# Altium project steering_wheel_unit.PrjPcb (part 1 of 2)
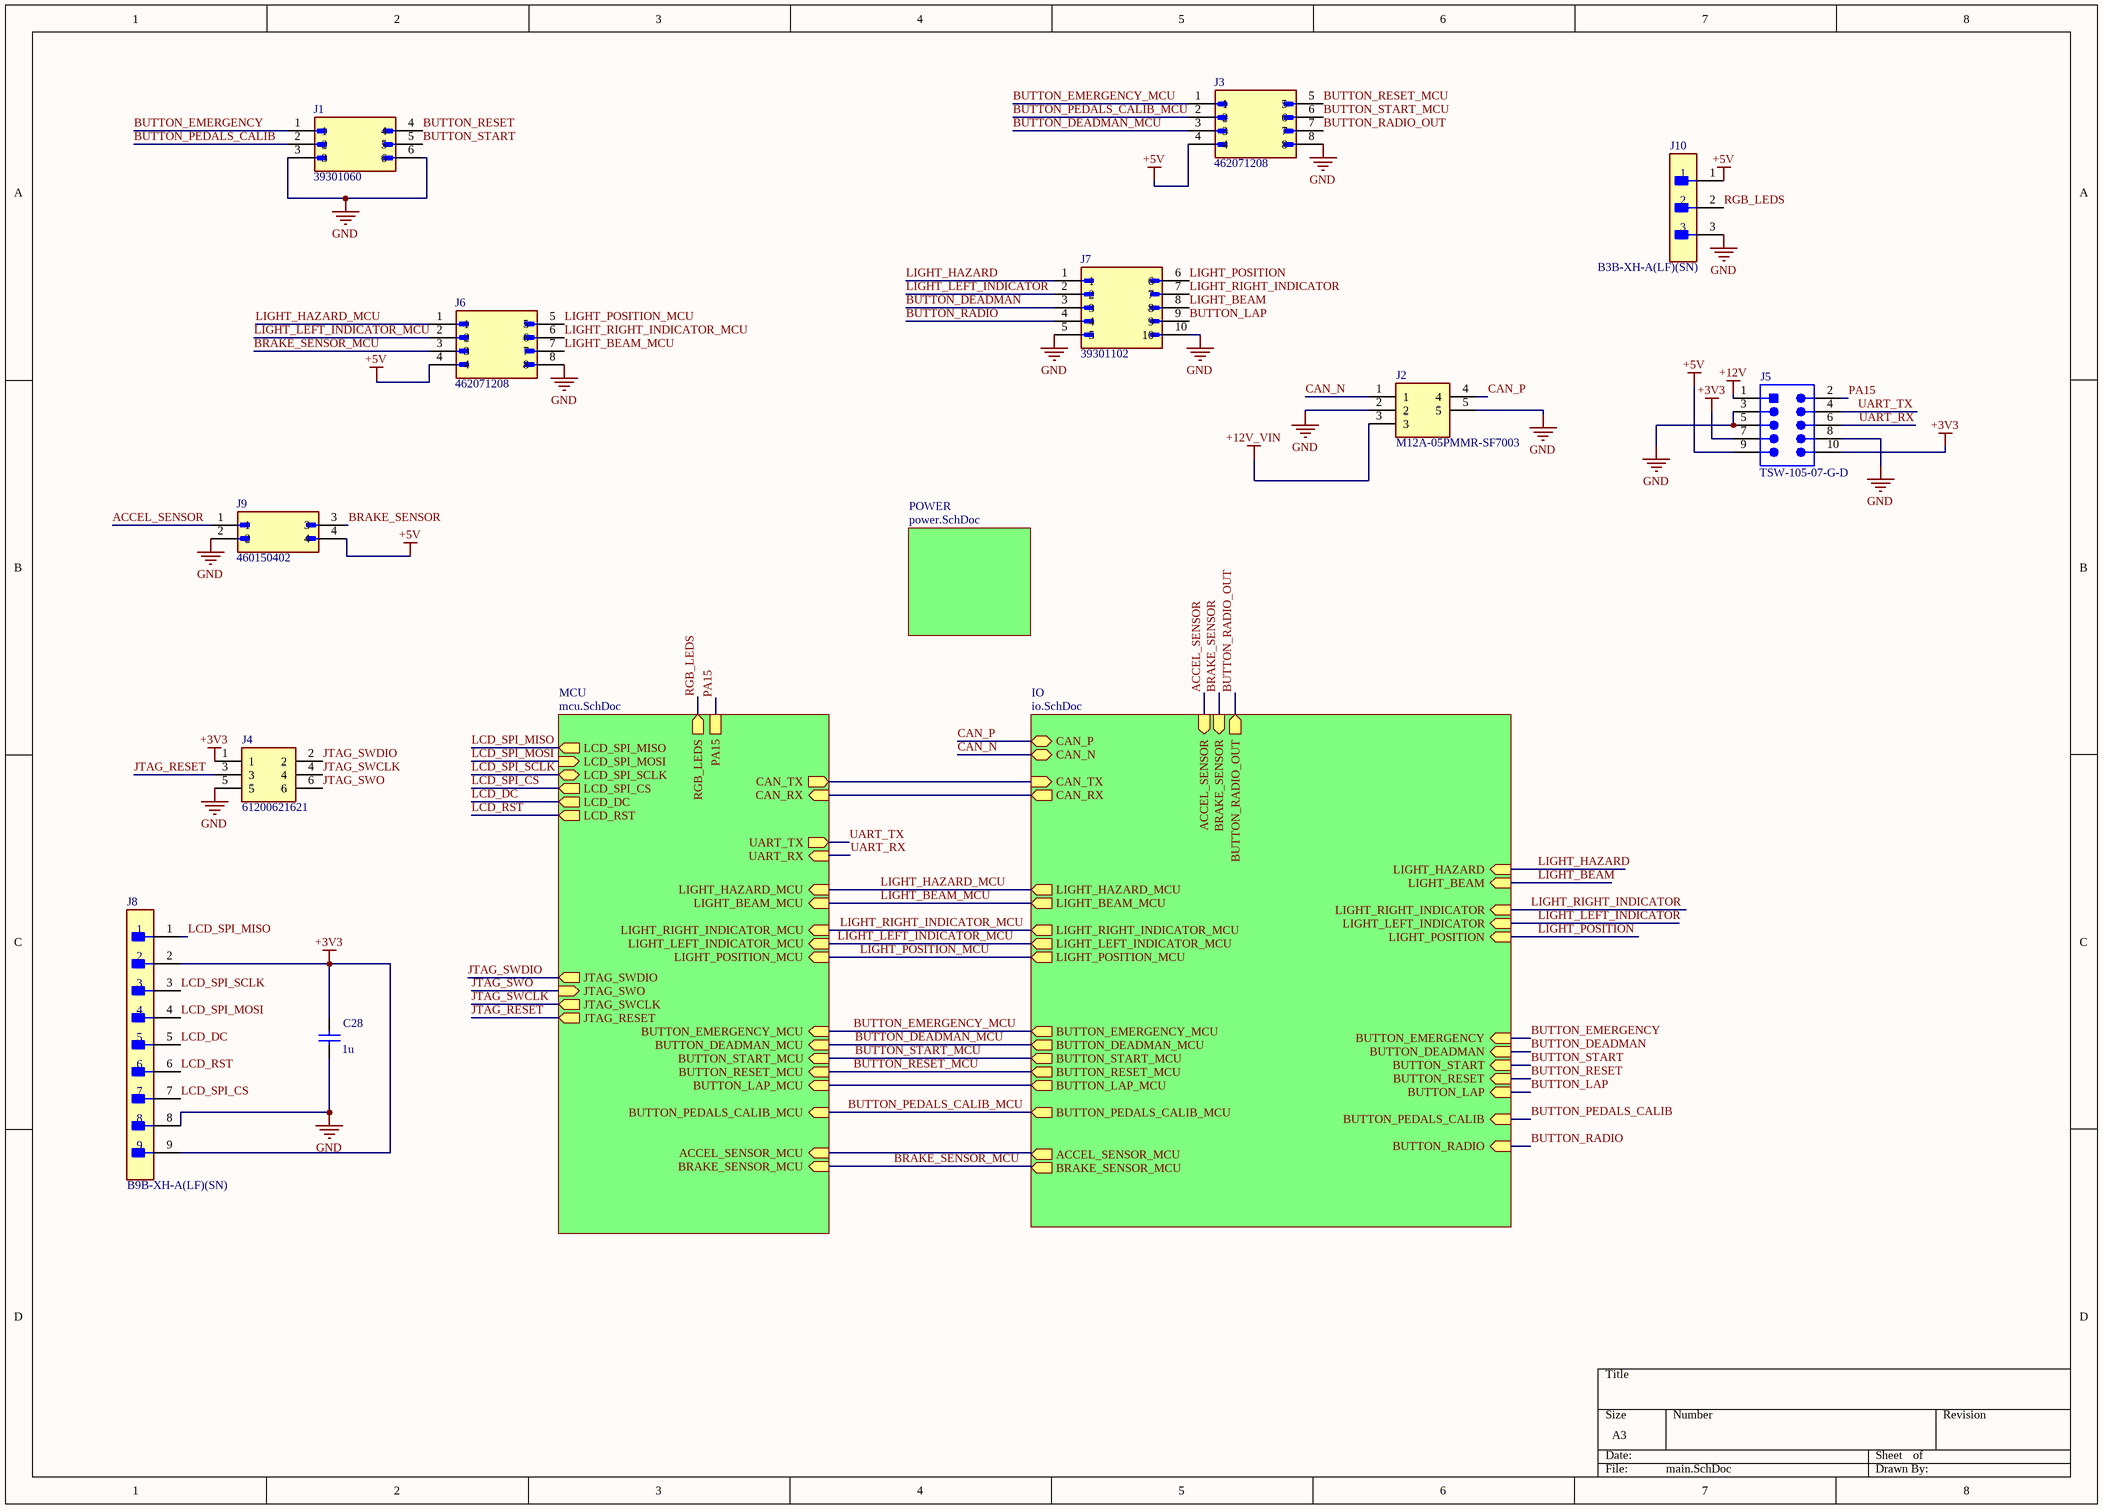
[diagram p0: main.SchDoc]
4 sheets, 161 parts. Net scope: hierarchical (ports join the sheet entries above them; power ports are global).
Board file: steering_wheel_pcb.PcbDoc
Sheets:
  main.SchDoc
    MCU = mcu.SchDoc
    IO = io.SchDoc
    POWER = power.SchDoc

## Sheet main.SchDoc
size A3; SheetNumber: 1; SheetTotal: 4

### Parts
C28  1u  [CAPC1206(3216)150_L]
J1  39301060  [39301060]
J2  M12A-05PMMR-SF7003  [M12A05PMMRSF7003]
J3  462071208  [462071208]
J4  61200621621  [61200621621]
J5  TSW-105-07-G-D  [SMTC-TSW-105-07-G-D_V]
J6  462071208  [462071208]
J7  39301102  [39301102]
J8  B9B-XH-A(LF)(SN)  [FP-B9B-XH-A_LF_SN-MFG]
J9  460150402  [460150402]
J10  B3B-XH-A(LF)(SN)  [FP-B3B-XH-A_LF_SN-MFG]

### Sub-sheets
IO = io.SchDoc: CAN_TX (in), CAN_RX (out), CAN_P (bidir), CAN_N (bidir), LIGHT_HAZARD_MCU (out), LIGHT_BEAM_MCU (out), LIGHT_RIGHT_INDICATOR_MCU (out), LIGHT_LEFT_INDICATOR_MCU (out), LIGHT_POSITION_MCU (out), LIGHT_HAZARD (in), LIGHT_BEAM (in), LIGHT_RIGHT_INDICATOR (in), LIGHT_LEFT_INDICATOR (in), LIGHT_POSITION (in), BUTTON_EMERGENCY_MCU (out), BUTTON_DEADMAN_MCU (out), BUTTON_START_MCU (out), BUTTON_RESET_MCU (out), BUTTON_LAP_MCU (out), BUTTON_PEDALS_CALIB_MCU (out), BUTTON_EMERGENCY (in), BUTTON_DEADMAN (in), BUTTON_START (in), BUTTON_RESET (in), BUTTON_LAP (in), BUTTON_PEDALS_CALIB (in), BUTTON_RADIO (in), ACCEL_SENSOR_MCU (out), BRAKE_SENSOR_MCU (out), ACCEL_SENSOR (in), BRAKE_SENSOR (in), BUTTON_RADIO_OUT (out)
MCU = mcu.SchDoc: CAN_TX (out), CAN_RX (in), UART_TX (out), UART_RX (in), JTAG_SWDIO (out), JTAG_SWO (in), JTAG_SWCLK (out), JTAG_RESET (out), LCD_SPI_MISO (out), LCD_SPI_MOSI (in), LCD_SPI_SCLK (bidir), LCD_SPI_CS (out), LCD_DC (out), LCD_RST (out), LIGHT_HAZARD_MCU (in), LIGHT_BEAM_MCU (in), LIGHT_RIGHT_INDICATOR_MCU (in), LIGHT_LEFT_INDICATOR_MCU (in), LIGHT_POSITION_MCU (in), BUTTON_EMERGENCY_MCU (in), BUTTON_DEADMAN_MCU (in), BUTTON_START_MCU (in), BUTTON_RESET_MCU (in), BUTTON_LAP_MCU (in), BUTTON_PEDALS_CALIB_MCU (in), PA15, ACCEL_SENSOR_MCU (in), BRAKE_SENSOR_MCU (in), RGB_LEDS (out)
POWER = power.SchDoc: no entries

### Nets
+3V3: C28.1 J4.1 J5.7 J5.10 J8.2 J8.9
+5V: J3.4 J5.9 J6.4 J9.4 J10.1
+12V: J5.1
+12V_VIN: J2.3
GND: C28.2 J1.3 J1.6 J2.2 J2.5 J3.8 J4.5 J5.3 J5.5 J5.8 J6.8 J7.5 J7.10 J8.8 J9.2 J10.3
ACCEL_SENSOR: J9.1 ; sheet IO/ACCEL_SENSOR
ACCEL_SENSOR_MCU: sheet MCU/ACCEL_SENSOR_MCU, sheet IO/ACCEL_SENSOR_MCU
BRAKE_SENSOR: J9.3 ; sheet IO/BRAKE_SENSOR
BRAKE_SENSOR_MCU: J6.3 ; sheet MCU/BRAKE_SENSOR_MCU, sheet IO/BRAKE_SENSOR_MCU
BUTTON_DEADMAN: J7.3 ; sheet IO/BUTTON_DEADMAN
BUTTON_DEADMAN_MCU: J3.3 ; sheet MCU/BUTTON_DEADMAN_MCU, sheet IO/BUTTON_DEADMAN_MCU
BUTTON_EMERGENCY: J1.1 ; sheet IO/BUTTON_EMERGENCY
BUTTON_EMERGENCY_MCU: J3.1 ; sheet MCU/BUTTON_EMERGENCY_MCU, sheet IO/BUTTON_EMERGENCY_MCU
BUTTON_LAP: J7.9 ; sheet IO/BUTTON_LAP
BUTTON_LAP_MCU: sheet MCU/BUTTON_LAP_MCU, sheet IO/BUTTON_LAP_MCU
BUTTON_PEDALS_CALIB: J1.2 ; sheet IO/BUTTON_PEDALS_CALIB
BUTTON_PEDALS_CALIB_MCU: J3.2 ; sheet MCU/BUTTON_PEDALS_CALIB_MCU, sheet IO/BUTTON_PEDALS_CALIB_MCU
BUTTON_RADIO: J7.4 ; sheet IO/BUTTON_RADIO
BUTTON_RADIO_OUT: J3.7 ; sheet IO/BUTTON_RADIO_OUT
BUTTON_RESET: J1.4 ; sheet IO/BUTTON_RESET
BUTTON_RESET_MCU: J3.5 ; sheet MCU/BUTTON_RESET_MCU, sheet IO/BUTTON_RESET_MCU
BUTTON_START: J1.5 ; sheet IO/BUTTON_START
BUTTON_START_MCU: J3.6 ; sheet MCU/BUTTON_START_MCU, sheet IO/BUTTON_START_MCU
CAN_N: J2.1 ; sheet IO/CAN_N
CAN_P: J2.4 ; sheet IO/CAN_P
CAN_RX: sheet MCU/CAN_RX, sheet IO/CAN_RX
CAN_TX: sheet MCU/CAN_TX, sheet IO/CAN_TX
JTAG_RESET: J4.3 ; sheet MCU/JTAG_RESET
JTAG_SWCLK: J4.4 ; sheet MCU/JTAG_SWCLK
JTAG_SWDIO: J4.2 ; sheet MCU/JTAG_SWDIO
JTAG_SWO: J4.6 ; sheet MCU/JTAG_SWO
LCD_DC: J8.5 ; sheet MCU/LCD_DC
LCD_RST: J8.6 ; sheet MCU/LCD_RST
LCD_SPI_CS: J8.7 ; sheet MCU/LCD_SPI_CS
LCD_SPI_MISO: J8.1 ; sheet MCU/LCD_SPI_MISO
LCD_SPI_MOSI: J8.4 ; sheet MCU/LCD_SPI_MOSI
LCD_SPI_SCLK: J8.3 ; sheet MCU/LCD_SPI_SCLK
LIGHT_BEAM: J7.8 ; sheet IO/LIGHT_BEAM
LIGHT_BEAM_MCU: J6.7 ; sheet MCU/LIGHT_BEAM_MCU, sheet IO/LIGHT_BEAM_MCU
LIGHT_HAZARD: J7.1 ; sheet IO/LIGHT_HAZARD
LIGHT_HAZARD_MCU: J6.1 ; sheet MCU/LIGHT_HAZARD_MCU, sheet IO/LIGHT_HAZARD_MCU
LIGHT_LEFT_INDICATOR: J7.2 ; sheet IO/LIGHT_LEFT_INDICATOR
LIGHT_LEFT_INDICATOR_MCU: J6.2 ; sheet MCU/LIGHT_LEFT_INDICATOR_MCU, sheet IO/LIGHT_LEFT_INDICATOR_MCU
LIGHT_POSITION: J7.6 ; sheet IO/LIGHT_POSITION
LIGHT_POSITION_MCU: J6.5 ; sheet MCU/LIGHT_POSITION_MCU, sheet IO/LIGHT_POSITION_MCU
LIGHT_RIGHT_INDICATOR: J7.7 ; sheet IO/LIGHT_RIGHT_INDICATOR
LIGHT_RIGHT_INDICATOR_MCU: J6.6 ; sheet MCU/LIGHT_RIGHT_INDICATOR_MCU, sheet IO/LIGHT_RIGHT_INDICATOR_MCU
PA15: J5.2 ; sheet MCU/PA15
RGB_LEDS: J10.2 ; sheet MCU/RGB_LEDS
UART_RX: J5.6 ; sheet MCU/UART_RX
UART_TX: J5.4 ; sheet MCU/UART_TX

### Library data of the parts
C28 = CMP-1037-04778-1: CAP 1.8uF 10V ±5% 1206 (3216 Metric) Thickness 1.45mm SMD; Case-EIA: 1206; Tolerance: Â±5%; Case-Metric: 3216; Technology: SMT; Value: 1.8uF; Rated Voltage: 10 V; Max Thickness: 1.45 mm
J1 = 39301060: Mini-Fit Jr. Through Hole PCB Header, Right Angle, 6 Contacts, 2 Rows, 4.2mm Pitch; Manufacturer: Molex; Manufacturer Lifecycle Status: ACTIVE; Approvals: CSA, TUV, UL; Connector Type: Power, Rectangular; Contact Resistance: 10mΩ; Current Rating: 8A; Gender: Male; Glow Wire Compliant: Non-compliant; Insulation Resistance: 1GΩ; Max Voltage Rating (AC): 600V; Number of Circuits: 4; Number of Contacts: 6; Number of Lines: 2; Plating Thickness: 2.54µm; Row Spacing: 5.5mm; Test Voltage: 1.5kV; Price: None; Value: *; Availability: Unavailable; MP: 39301060; Package: None; Supplier: RS; Supplier Part Number: 5109859P; Manufacturer Part Number: 39-30-1060; RoHS: Compliant; Category: Headers and Wire Housings; Stock: 3490; China RoHS: Compliant; Color: Natural; Contact Gender: Male; Contact Material: Brass; Contact Plating: Tin; Country of Origin: US; Depth: 12.8mm; ELV: Compliant; Flammability Rating: UL94 V-2; Halogen Free: Low Halogen; Height: 11.65mm; Housing Color: Natural; Housing Material: Nylon; Lead Free: Lead Free; Lead Pitch: 4.2mm; Length: 13.8mm; Lifecycle Status: Production; Material: Nylon; Max Current Rating: 8A; Max Operating Temperature: 105°C; Min Operating Temperature: -40°C; Mounting Technology: PCB, Through Hole; Pins: 6; Number of Poles: 6; Number of Positions: 6; Number of Rows: 1; Orientation: Right Angle, Vertical; Packaging: Bulk; Pitch: 4.2mm; Radiation Hardening: No; REACH SVHC: Yes; Schedule B: 8536694040, 8536694040|8536694040|8536694040|8536694040|8536694040|8536694040|8536694040|8536694040|8536694040|8536694040|8536694040|8536694040|8536694040|8536694040|8536694040|8536694040|8536694040|8536694040|8536694040|8536694040|8536694040|8536694040|8536694040|85; Termination: Solder; Voltage Rating: 600V; Voltage Rating (AC): 600V; Voltage Rating (DC): 600V; Working Voltage: 600V; ComponentLink1URL: https://datasheet.octopart.com:443/39-30-1060-Molex-datasheet-120074128.pdf?src-supplier=Farnell; ComponentLink1Description: https://datasheet.octopart.com:443/39-30-1060-Molex-datasheet-120074128.pdf?src-supplier=Farnell; ComponentLink2URL: https://datasheet.octopart.com:443/39-30-1060-Molex-datasheet-101582409.pdf?src-supplier=Farnell; ComponentLink2Description: https://datasheet.octopart.com:443/39-30-1060-Molex-datasheet-101582409.pdf?src-supplier=Farnell; ComponentLink3URL: https://datasheet.octopart.com:443/39-30-1060-Molex-datasheet-14359237.pdf?src-supplier=Farnell; ComponentLink3Description: https://datasheet.octopart.com:443/39-30-1060-Molex-datasheet-14359237.pdf?src-supplier=Farnell; ComponentLink4URL: https://datasheet.octopart.com:443/39-30-1060-Molex-datasheet-8451564.pdf?src-supplier=Farnell; ComponentLink4Description: https://datasheet.octopart.com:443/39-30-1060-Molex-datasheet-8451564.pdf?src-supplier=Farnell; ComponentLink5URL: https://datasheet.octopart.com:443/39-30-1060-Molex-datasheet-8377082.pdf?src-supplier=Farnell; ComponentLink5Description: https://datasheet.octopart.com:443/39-30-1060-Molex-datasheet-8377082.pdf?src-supplier=Farnell; ComponentLink6URL: https://datasheet.octopart.com:443/39-30-1060-Molex-datasheet-8338264.pdf?src-supplier=Farnell; ComponentLink6Description: https://datasheet.octopart.com:443/39-30-1060-Molex-datasheet-8338264.pdf?src-supplier=Farnell; ComponentLink7URL: https://datasheet.octopart.com:443/039301060-Molex-datasheet-8338717.pdf?src-supplier=Upverter; ComponentLink7Description: https://datasheet.octopart.com:443/039301060-Molex-datasheet-8338717.pdf?src-supplier=Upverter; ComponentLink8URL: https://datasheet.octopart.com:443/39-30-1060-Molex-datasheet-13785479.pdf?src-supplier=Sager+Electronics; ComponentLink8Description: https://datasheet.octopart.com:443/39-30-1060-Molex-datasheet-13785479.pdf?src-supplier=Sager+Electronics; ComponentLink9URL: https://sigma.octopart.com:443/15644801/technical_drawing/Molex-39-30-1060.pdf?src-supplier=Molex; ComponentLink9Description: https://sigma.octopart.com:443/15644801/technical_drawing/Molex-39-30-1060.pdf?src-supplier=Molex; ComponentLink10URL: https://datasheet.octopart.com:443/39-30-1060-Molex-datasheet-154749339.pdf?src-supplier=Master+Electronics; ComponentLink10Description: https://datasheet.octopart.com:443/39-30-1060-Molex-datasheet-154749339.pdf?src-supplier=Master+Electronics; ComponentLink11URL: https://datasheet.octopart.com:443/39-30-1060-Molex-datasheet-34205327.pdf?src-supplier=Electro+Sonic; ComponentLink11Description: https://datasheet.octopart.com:443/39-30-1060-Molex-datasheet-34205327.pdf?src-supplier=Electro+Sonic; ComponentLink12URL: https://datasheet.octopart.com:443/39-30-1060-Molex-datasheet-62104200.pdf?src-supplier=Electro+Sonic; ComponentLink12Description: https://datasheet.octopart.com:443/39-30-1060-Molex-datasheet-62104200.pdf?src-supplier=Electro+Sonic; ComponentLink13URL: https://datasheet.octopart.com:443/39-30-1060-Molex-datasheet-23709672.pdf?src-supplier=Electro+Sonic; ComponentLink13Description: https://datasheet.octopart.com:443/39-30-1060-Molex-datasheet-23709672.pdf?src-supplier=Electro+Sonic; ComponentLink14URL: https://datasheet.octopart.com:443/39-30-1060-Molex-datasheet-140183176.pdf?src-supplier=RS+(Formerly+Allied+Electronics); ComponentLink14Description: https://datasheet.octopart.com:443/39-30-1060-Molex-datasheet-140183176.pdf?src-supplier=RS+(Formerly+Allied+Electronics); ComponentLink15URL: https://datasheet.octopart.com:443/39-30-1060-Molex-datasheet-120148730.pdf?src-supplier=RS+(Formerly+Allied+Electronics); ComponentLink15Description: https://datasheet.octopart.com:443/39-30-1060-Molex-datasheet-120148730.pdf?src-supplier=RS+(Formerly+Allied+Electronics); ComponentLink16URL: https://datasheet.octopart.com:443/39-30-1060-Molex-datasheet-34442213.pdf?src-supplier=RS+(Formerly+Allied+Electronics); ComponentLink16Description: https://datasheet.octopart.com:443/39-30-1060-Molex-datasheet-34442213.pdf?src-supplier=RS+(Formerly+Allied+Electronics); ComponentLink17URL: https://datasheet.octopart.com:443/39-30-1060-Molex-datasheet-9719424.pdf?src-supplier=RS+(Formerly+Allied+Electronics); ComponentLink17Description: https://datasheet.octopart.com:443/39-30-1060-Molex-datasheet-9719424.pdf?src-supplier=RS+(Formerly+Allied+Electronics); ComponentLink18URL: https://datasheet.octopart.com:443/39-30-1060-Molex-datasheet-72655.pdf?src-supplier=RS+(Formerly+Allied+Electronics); ComponentLink18Description: https://datasheet.octopart.com:443/39-30-1060-Molex-datasheet-72655.pdf?src-supplier=RS+(Formerly+Allied+Electronics); ComponentLink19URL: https://datasheet.octopart.com:443/39-30-1060-Molex-datasheet-166013077.pdf?src-supplier=Jameco; ComponentLink19Description: https://datasheet.octopart.com:443/39-30-1060-Molex-datasheet-166013077.pdf?src-supplier=Jameco; ComponentLink20URL: https://datasheet.octopart.com:443/39301060-Molex-datasheet-8215776.pdf?src-supplier=Jameco; ComponentLink20Description: https://datasheet.octopart.com:443/39301060-Molex-datasheet-8215776.pdf?src-supplier=Jameco; ComponentLink21URL: https://datasheet.octopart.com:443/39-30-1060-Molex-datasheet-33002875.pdf?src-supplier=Newark; ComponentLink21Description: https://datasheet.octopart.com:443/39-30-1060-Molex-datasheet-33002875.pdf?src-supplier=Newark; ComponentLink22URL: https://datasheet.octopart.com:443/39-30-1060-Molex-datasheet-21207487.pdf?src-supplier=Newark; ComponentLink22Description: https://datasheet.octopart.com:443/39-30-1060-Molex-datasheet-21207487.pdf?src-supplier=Newark; ComponentLink23URL: https://datasheet.octopart.com:443/39-30-1060-Molex-datasheet-2405.pdf?src-supplier=Newark; ComponentLink23Description: https://datasheet.octopart.com:443/39-30-1060-Molex-datasheet-2405.pdf?src-supplier=Newark; ComponentLink24URL: https://datasheet.octopart.com:443/39-30-1060-Molex-datasheet-21395541.pdf?src-supplier=TME; ComponentLink24Description: https://datasheet.octopart.com:443/39-30-1060-Molex-datasheet-21395541.pdf?src-supplier=TME; ComponentLink25URL: https://datasheet.octopart.com:443/0039301060-Molex-datasheet-11554567.pdf?src-supplier=Arrow+Electronics; ComponentLink25Description: https://datasheet.octopart.com:443/0039301060-Molex-datasheet-11554567.pdf?src-supplier=Arrow+Electronics; ComponentLink26URL: https://datasheet.octopart.com:443/39-30-1060-Molex-datasheet-8361750.pdf?src-supplier=Verical; ComponentLink26Description: https://datasheet.octopart.com:443/39-30-1060-Molex-datasheet-8361750.pdf?src-supplier=Verical; ComponentLink27URL: https://datasheet.octopart.com:443/39-30-1060-Molex-datasheet-129274.pdf?src-supplier=DigiKey; ComponentLink27Description: https://datasheet.octopart.com:443/39-30-1060-Molex-datasheet-129274.pdf?src-supplier=DigiKey; ComponentLink28URL: http://sigma.octopart.com:80/15645378/rohs_certificate/Molex-39-30-1060.pdf?src-supplier=Compliance+Statements; ComponentLink28Description: http://sigma.octopart.com:80/15645378/rohs_certificate/Molex-39-30-1060.pdf?src-supplier=Compliance+Statements; ComponentLink29URL: http://sigma.octopart.com:80/conflict_mineral_statement/Molex-company-72.pdf?src-supplier=Compliance+Statements; ComponentLink29Description: http://sigma.octopart.com:80/conflict_mineral_statement/Molex-company-72.pdf?src-supplier=Compliance+Statements; ComponentLink30URL: http://sigma.octopart.com:80/rohs_statement/Molex-company-73.pdf?src-supplier=Compliance+Statements; ComponentLink30Description: http://sigma.octopart.com:80/rohs_statement/Molex-company-73.pdf?src-supplier=Compliance+Statements; ComponentLink31URL: http://sigma.octopart.com:80/reach_statement/Molex-company-74.pdf?src-supplier=Compliance+Statements; ComponentLink31Description: http://sigma.octopart.com:80/reach_statement/Molex-company-74.pdf?src-supplier=Compliance+Statements
J2 = M12A-05PMMR-SF7003: M12, A Code, 4A, 05 pins, Male Contact, Hexagonal, M12*1.0, PCB 90ø, Front Fastened, IP67; Manufacturer_Name: Amphenol; Manufacturer: Amphenol LTW; Geometry.Height: 15mm; Connector Type: Signal; Number of Positions: 5; Voltage Rating: 60V; Manufacturer_Part_Number: M12A-05PMMR-SF7003; Mouser Part Number: 523-M12A05PMMRSF7003; Mouser Price/Stock: https://www.mouser.co.uk/ProductDetail/Amphenol-LTW/M12A-05PMMR-SF7003?qs=f9yNj16SXrIdWSE1H9dLLQ%3D%3D; Arrow Part Number: M12A-05PMMR-SF7003; Arrow Price/Stock: https://www.arrow.com/en/products/m12a-05pmmr-sf7003/amphenol?utm_currency=USD&region=nac; Datasheet Link: https://amphenolltw.com/down.php?prod_files=605433; Supplier: Avnet; Supplier Part Number: 50AC2957; Manufacturer Part Number: M12A-05PMMR-SF7003; RoHS: Compliant; Category: Circular Connectors; Stock: 32; Current Rating: 4A; Gender: Male; Lifecycle Status: Production; Pins: 5; ComponentLink1URL: https://datasheet.octopart.com:443/M12A-05PMMR-SF7003-Amphenol-datasheet-182346588.pdf?src-supplier=IHS; ComponentLink1Description: https://datasheet.octopart.com:443/M12A-05PMMR-SF7003-Amphenol-datasheet-182346588.pdf?src-supplier=IHS; ComponentLink2URL: https://datasheet.octopart.com:443/M12A-05PMMR-SF7003-Amphenol-LTW-datasheet-184719079.pdf?src-supplier=TME; ComponentLink2Description: https://datasheet.octopart.com:443/M12A-05PMMR-SF7003-Amphenol-LTW-datasheet-184719079.pdf?src-supplier=TME; ComponentLink3URL: https://datasheet.octopart.com:443/M12A-05PMMR-SF7003-Amphenol-LTW-datasheet-180194516.pdf?src-supplier=JRH+Electronics; ComponentLink3Description: https://datasheet.octopart.com:443/M12A-05PMMR-SF7003-Amphenol-LTW-datasheet-180194516.pdf?src-supplier=JRH+Electronics
J3 J6 = 462071208: Mini-Fit Jr 46207 ROHS3Compliant Tin Solder Connector Header 100.0muin 2.54mum; Manufacturer: Molex; Manufacturer Part Number: 46207-1208; Manufacturer Lifecycle Status: ACTIVE; Current Rating: 9A; Dielectric Material: Polyethylene; Number of Circuits: 8; Pitch: 4.2mm; Voltage Rating: 600V; Package: None; Value: *; MP: 462071208; Availability: Unavailable; Price: None; Supplier: Farnell; Supplier Part Number: 3536728; RoHS: Compliant; Category: Headers and Wire Housings; Stock: 3316; China RoHS: Compliant; Color: Black; Contact Gender: Female; Contact Material: Brass; Contact Plating: Tin; Country of Origin: MX; Glow Wire Compliant: Compliant; Halogen Free: Low Halogen; Housing Material: Thermoplastic; Lifecycle Status: Production; Max Operating Temperature: 105°C; Min Operating Temperature: -40°C; Pins: 8; Number of Positions: 8; Number of Rows: 2; Orientation: Vertical; REACH SVHC: Yes; Row Spacing: 4.2mm; Termination: Through Hole; ComponentLink1URL: https://datasheet.octopart.com:443/462071208-Molex-datasheet-180773589.pdf?src-supplier=IHS; ComponentLink1Description: https://datasheet.octopart.com:443/462071208-Molex-datasheet-180773589.pdf?src-supplier=IHS; ComponentLink2URL: https://datasheet.octopart.com:443/462071208-Molex-datasheet-16395072.pdf?src-supplier=Molex; ComponentLink2Description: https://datasheet.octopart.com:443/462071208-Molex-datasheet-16395072.pdf?src-supplier=Molex; ComponentLink3URL: https://datasheet.octopart.com:443/46207-1208-Molex-datasheet-12571497.pdf?src-supplier=Molex; ComponentLink3Description: https://datasheet.octopart.com:443/46207-1208-Molex-datasheet-12571497.pdf?src-supplier=Molex; ComponentLink4URL: https://datasheet.octopart.com:443/46207-1208-Molex-datasheet-175423246.pdf?src-supplier=Newark; ComponentLink4Description: https://datasheet.octopart.com:443/46207-1208-Molex-datasheet-175423246.pdf?src-supplier=Newark; ComponentLink5URL: https://datasheet.octopart.com:443/0462071208-Molex-datasheet-11743555.pdf?src-supplier=Arrow+Electronics; ComponentLink5Description: https://datasheet.octopart.com:443/0462071208-Molex-datasheet-11743555.pdf?src-supplier=Arrow+Electronics; ComponentLink6URL: http://sigma.octopart.com:80/16395073/rohs_statement/Molex-462071208.pdf?src-supplier=Compliance+Statements; ComponentLink6Description: http://sigma.octopart.com:80/16395073/rohs_statement/Molex-462071208.pdf?src-supplier=Compliance+Statements; ComponentLink7URL: http://sigma.octopart.com:80/reach_statement/Molex-company-74.pdf?src-supplier=Compliance+Statements; ComponentLink7Description: http://sigma.octopart.com:80/reach_statement/Molex-company-74.pdf?src-supplier=Compliance+Statements; ComponentLink8URL: http://sigma.octopart.com:80/rohs_statement/Molex-company-73.pdf?src-supplier=Compliance+Statements; ComponentLink8Description: http://sigma.octopart.com:80/rohs_statement/Molex-company-73.pdf?src-supplier=Compliance+Statements; ComponentLink9URL: http://sigma.octopart.com:80/conflict_mineral_statement/Molex-company-72.pdf?src-supplier=Compliance+Statements; ComponentLink9Description: http://sigma.octopart.com:80/conflict_mineral_statement/Molex-company-72.pdf?src-supplier=Compliance+Statements
J4 = 61200621621: Conn Shrouded Header (4 Sides) M 6 POS 2.54mm Solder ST Top Entry Thru-Hole Tray; Manufacturer_Name: Wurth Elektronik; Geometry.Height: 9.1mm; Connector Type: Male Pin; Contact Resistance: 20mΩ; Current Rating: 3A; Gender: Male; Insulation Resistance: 1GΩ; Number of Contacts: 6; Operating Supply Voltage: 250V; Manufacturer_Part_Number: 61200621621; Mouser Part Number: 710-61200621621; Mouser Price/Stock: https://www.mouser.co.uk/ProductDetail/Wurth-Elektronik/61200621621?qs=PhR8RmCirEbjX8n1RKw4Jw%3D%3D; Arrow Part Number: *; Arrow Price/Stock: *; Datasheet Link: https://katalog.we-online.de/em/datasheet/6120xx21621.pdf; Supplier: RS; Supplier Part Number: 8236430; Manufacturer: Wurth Elektronik; Manufacturer Part Number: 61200621621; RoHS: Compliant; Category: Headers and Wire Housings; Stock: 450; Color: Black; Contact Material: Copper; Contact Plating: Gold; Insulation Material: PBT; Lead Pitch: 2.54mm; Length: 15.28mm; Max Operating Temperature: 105°C; Min Operating Temperature: -40°C; Mounting Technology: Through Hole; Pins: 6; Number of Positions: 6; Number of Rows: 2; Orientation: Vertical; Pitch: 2.54mm; Row Spacing: 2.54mm; Termination: Solder; ComponentLink1URL: https://datasheet.octopart.com:443/61200621621-Wurth-Elektronik-datasheet-168479915.pdf?src-supplier=Newark; ComponentLink1Description: https://datasheet.octopart.com:443/61200621621-Wurth-Elektronik-datasheet-168479915.pdf?src-supplier=Newark; ComponentLink2URL: https://datasheet.octopart.com:443/61200621621-W%C3%BCrth-Elektronik-datasheet-5367532.pdf?src-supplier=Newark; ComponentLink2Description: https://datasheet.octopart.com:443/61200621621-W%C3%BCrth-Elektronik-datasheet-5367532.pdf?src-supplier=Newark; ComponentLink3URL: https://datasheet.octopart.com:443/61200621621-W%C3%BCrth-Elektronik-datasheet-62127819.pdf?src-supplier=Upverter; ComponentLink3Description: https://datasheet.octopart.com:443/61200621621-W%C3%BCrth-Elektronik-datasheet-62127819.pdf?src-supplier=Upverter; ComponentLink4URL: https://datasheet.octopart.com:443/61200621621-W%C3%BCrth-Elektronik-datasheet-111087935.pdf?src-supplier=Wurth+Elektronik; ComponentLink4Description: https://datasheet.octopart.com:443/61200621621-W%C3%BCrth-Elektronik-datasheet-111087935.pdf?src-supplier=Wurth+Elektronik; ComponentLink5URL: https://datasheet.octopart.com:443/61200621621-W%C3%BCrth-Elektronik-datasheet-149523874.pdf?src-supplier=Farnell; ComponentLink5Description: https://datasheet.octopart.com:443/61200621621-W%C3%BCrth-Elektronik-datasheet-149523874.pdf?src-supplier=Farnell
J5 = CMP-2000-07330-1: Post Terminal Strip Assembly, Pitch 2.54 mm, 2 x 5 Position, Height 8.58 mm, Tail Length 2.54 mm, -55 to 125 degC, RoHS, Bulk; Manufacturer: Samtec-Inc.; Connector Type: Header,Unshrouded; Number of Positions Loaded: All; Pitch: 0.100"(2.54mm); Number of Positions: 10; Package Reference: TSW-105-07-G-D; Mounting Technology: ThroughHole; Datasheet URL: http://suddendocs.samtec.com/prints/tsw-xxx-xx-xxx-x-xx-xxx-mkt.pdf; Termination: Solder; Packaging: Bulk; Number of Rows: 2; Contact Finish: Gold; Mounting Type: ThroughHole; Features: -; Color: Black; Category: Connectors,Interconnects; Family: RectangularConnectors-Headers,MalePins; Manufacturer URL: http://www.samtec.com/; Series: TSW; Fastening Type: -; Package URL: http://suddendocs.samtec.com/prints/tsw-xxx-xx-x-x-xx-xxx-footprint.pdf; Row Spacing: 0.100"(2.54mm); Contact Mating Length: 0.230"(5.84mm); Contact Finish Thickness: 10µin(0.25µm); Contact Type: MalePin; Package Description: Male Header, Pitch 2.54 mm, 2 x 5 Position, Height 8.58 mm, Tail Length 2.54 mm; Datasheet Version: Rev. DO, 08/1988
J7 = 39301102: Mini-Fit Jr. Header, Dual Row, Right Angle, with Snap-in Plastic Peg PCB Lock, 10 Circuits, PA Polyamide Nylon 6/6 94V-0, Tin (Sn) Plating; Value: *; Price: None; MP: 39301102; Availability: Unavailable; Package: None
J8 = CMP-17439-000168-1: CONN HEADER VERT 9POS 2.5MM; Wire/Cable Gauge: 22AWG; Current Rating: 3A; Insulation Resistance: 1GR; Mated Stacking Heights: 9.8mm; Max Voltage Rating (AC): 250V; Contact Resistance: 20mR; Gender: Male; Number of Contacts: 9; Orientation: Straight; Contact Finish - Mating: TIN; Number of Rows: 1; Max Operating Temperature: 85°C; Contact Plating: Tin; Flammability Rating: UL94 V-0; Length: 24.9mm; REACH SVHC: No SVHC; Depth: 5.75mm; Housing Color: White; Package Quantity: 250; Lead Pitch: 2.5mm; Connector Type: Header; Voltage Rating (AC): 250V; Packaging: Bulk; Color: Natural; Min Operating Temperature: -25°C; Insulation Color: Natural; Insulation Material: Nylon; Voltage Rating: 250V; Pitch: 2.5mm; Lead Free: Lead Free; Contact Shape: Square; Housing Material: Polyamide; Series: XH; Termination: Solder; Contact Type: Male Pin; Mount: Through Hole; Max Current Rating: 3A; Number of Positions: 9; Contact Material: Brass; Fastening Type: Detent
J9 = 460150402: vert header, DR, 4w, tin, UL94V-0 | Molex Incorporated 46015-0402; SnapEDA_Link: https://www.snapeda.com/parts/46015-0402/Molex/view-part/?ref=snap; Package: None; Value: *; MF: Molex; MP: 46015-0402; Check_prices: https://www.snapeda.com/parts/46015-0402/Molex/view-part/?ref=eda
J10 = CMP-17439-000014-3: CONN HEADER VERT 3POS 2.5MM; Max Voltage Rating (DC): 250V; Number of Positions: 3; Current Rating: 3A; Gender: Male; Wire/Cable Gauge: 22AWG; Contact Resistance: 20mR; Insulation Resistance: 1GR; Insulation Material: Nylon; Contact Plating: Tin; Depth: 5.75mm; Contact Type: Male Pin; Max Operating Temperature: 85°C; Insulation Color: Natural; Voltage Rating (AC): 250V; Color: Natural; Connector Type: Header; Orientation: Straight; Fastening Type: Detent; Housing Color: White; Min Operating Temperature: -25°C; Termination: Solder; Voltage Rating: 250V; Series: XH; Pitch: 2.5mm; Contact Shape: Square; Number of Rows: 1; Lead Free: Lead Free; Packaging: Bulk; Mount: Through Hole; Flammability Rating: UL94 V-0; Max Voltage Rating (AC): 250V; REACH SVHC: No SVHC; Housing Material: Polyamide; Contact Material: Brass; Lead Pitch: 2.5mm; Contact Finish - Mating: TIN; Length: 9.9mm; Max Current Rating: 3A; Number of Contacts: 3

## Sheet mcu.SchDoc
size A3; SheetNumber: 4; SheetTotal: 4
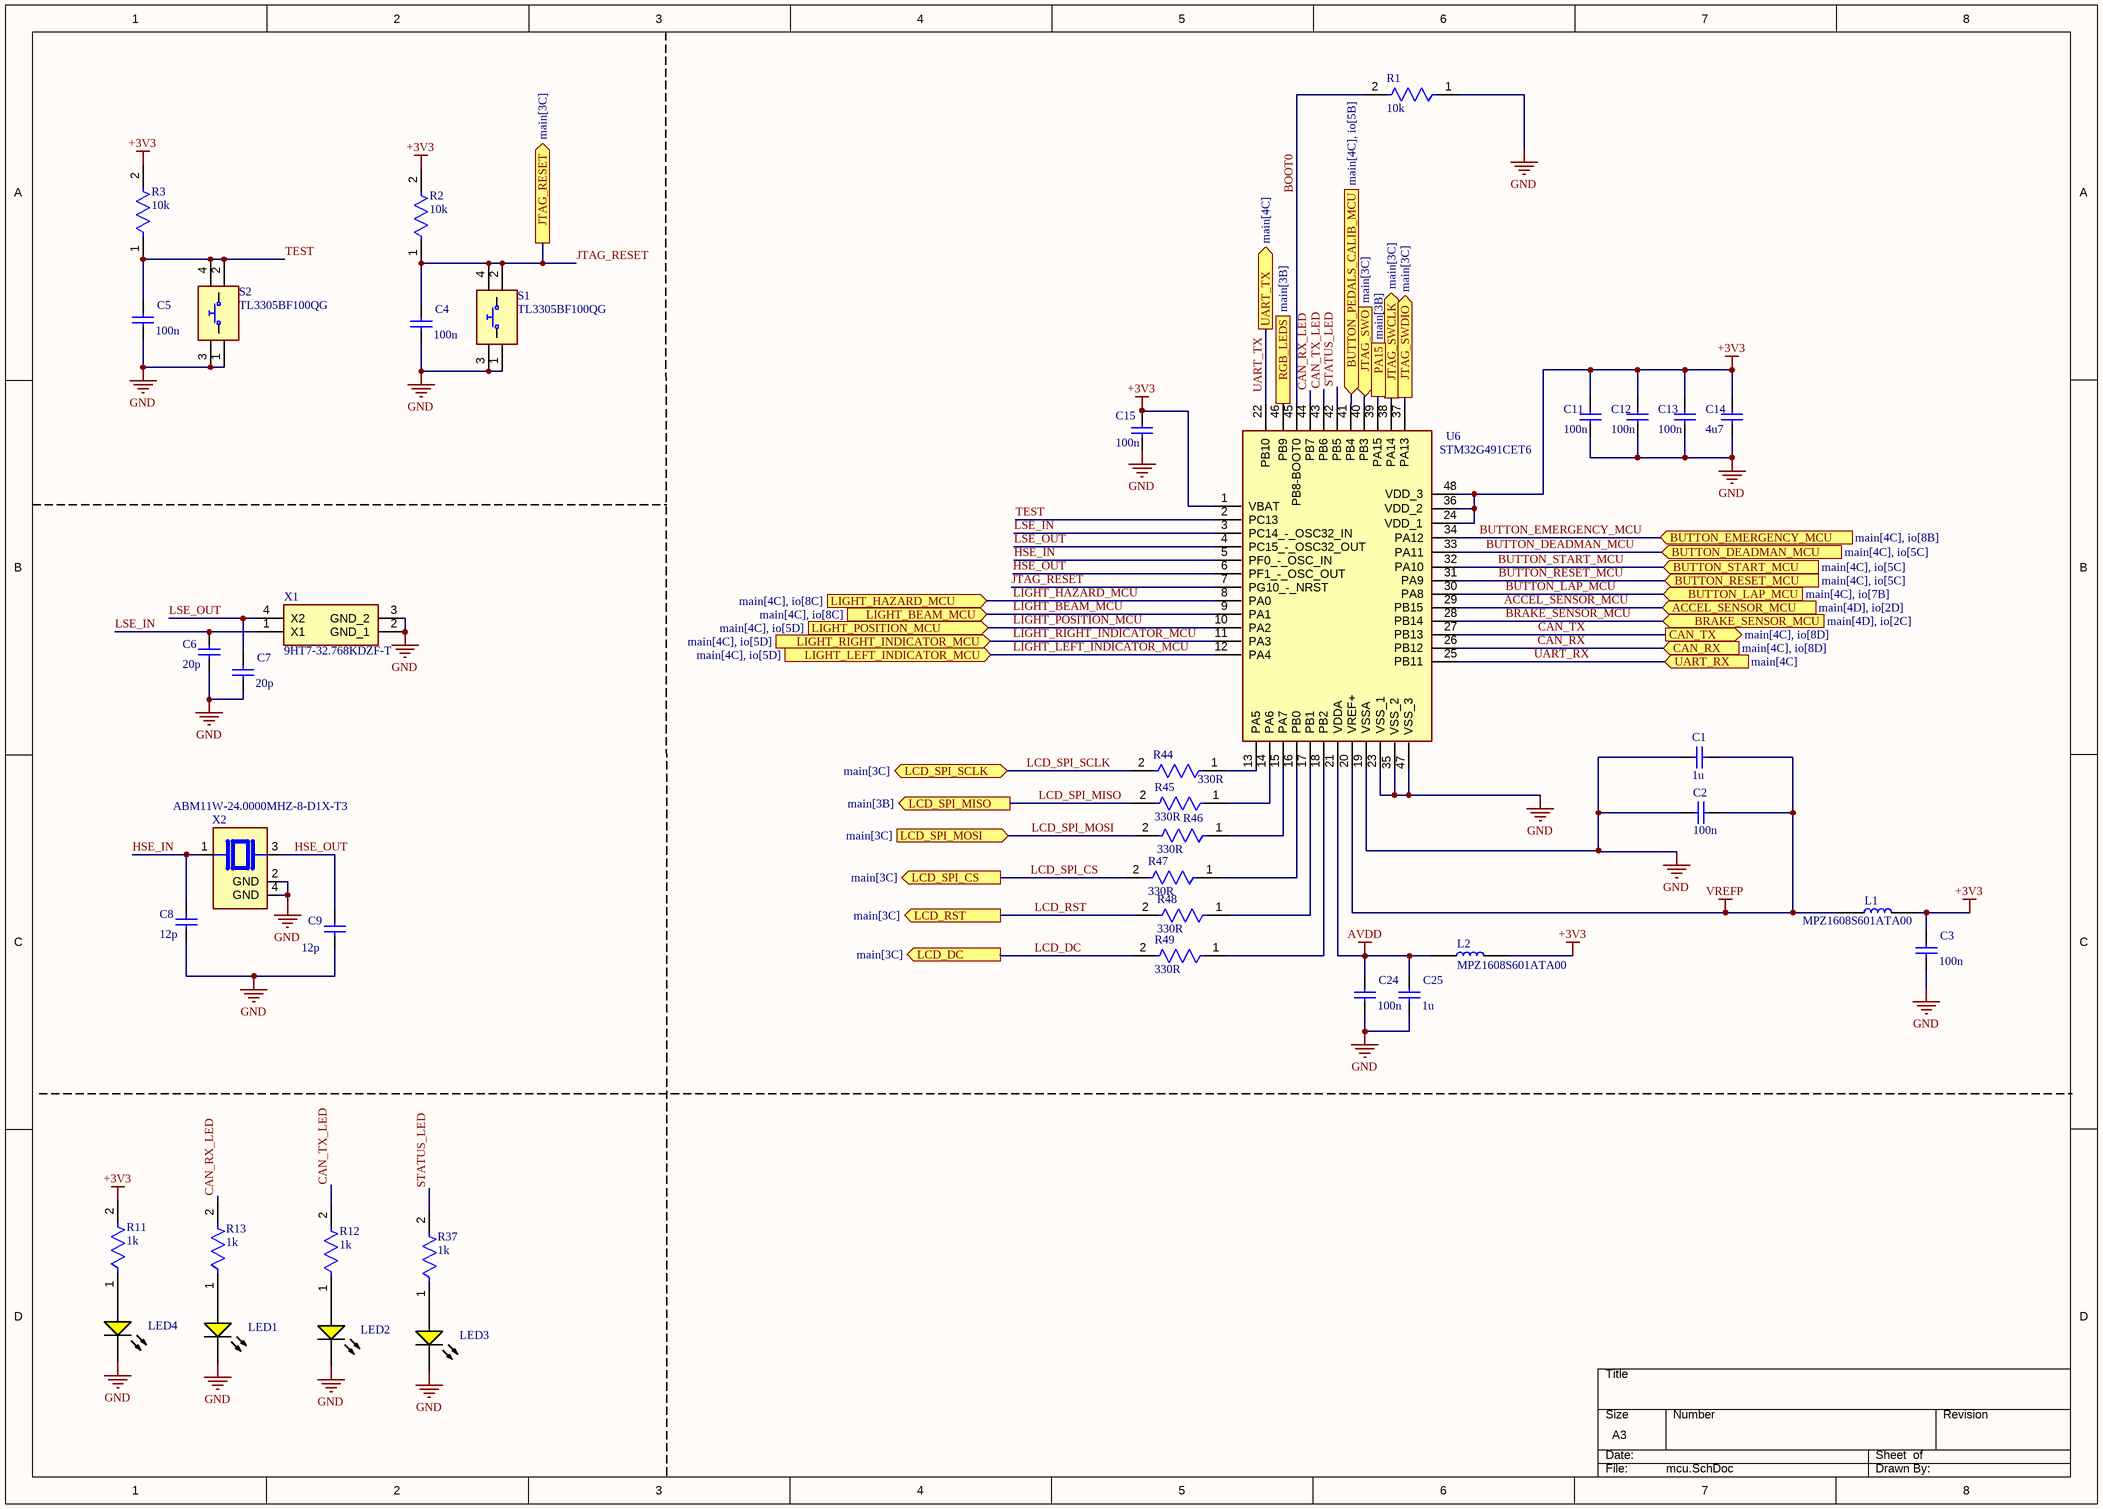
[diagram p1: mcu.SchDoc]

### Parts
C1  1u  [CAPC1206(3216)150_L]
C2  100n  [CAPC1206(3216)150_L]
C3  100n  [CAPC1206(3216)150_L]
C4  100n  [CAPC1206(3216)150_L]
C5  100n  [CAPC1206(3216)150_L]
C6  20p  [CAPC1206(3216)150_L]
C7  20p  [CAPC1206(3216)150_L]
C8  12p  [CAPC1206(3216)150_L]
C9  12p  [CAPC1206(3216)150_L]
C11  100n  [CAPC1206(3216)150_L]
C12  100n  [CAPC1206(3216)150_L]
C13  100n  [CAPC1206(3216)150_L]
C14  4u7  [CAPC1206(3216)150_L]
C15  100n  [CAPC1206(3216)150_L]
C24  100n  [CAPC1206(3216)150_L]
C25  1u  [CAPC1206(3216)150_L]
L1  MPZ1608S601ATA00  [INDC1608X95N]
L2  MPZ1608S601ATA00  [INDC1608X95N]
LED1  (no value)  [LUMX-SML-LX1206YC-TR_V]
LED2  (no value)  [LUMX-SML-LX1206YC-TR_V]
LED3  (no value)  [LUMX-SML-LX1206YC-TR_V]
LED4  (no value)  [LUMX-SML-LX1206YC-TR_V]
R1  10k  [FP-RK73H2B-MFG]
R2  10k  [FP-RK73H2B-MFG]
R3  10k  [FP-RK73H2B-MFG]
R11  1k  [FP-RK73H2B-MFG]
R12  1k  [FP-RK73H2B-MFG]
R13  1k  [FP-RK73H2B-MFG]
R37  1k  [FP-RK73H2B-MFG]
R44  330R  [FP-RK73H2B-MFG]
R45  330R  [FP-RK73H2B-MFG]
R46  330R  [FP-RK73H2B-MFG]
R47  330R  [FP-RK73H2B-MFG]
R48  330R  [FP-RK73H2B-MFG]
R49  330R  [FP-RK73H2B-MFG]
S1  TL3305BF100QG  [TL3305BF160QG]
S2  TL3305BF100QG  [TL3305BF160QG]
U6  STM32G491CET6  [STM32G491CET6]
X1  9HT7-32.768KDZF-T  [9HT732768KDZFT]
X2  ABM11W-24.0000MHZ-8-D1X-T3  [XTAL_ABM11W-24.0000MHZ-8-D1X-T3]

### Ports
ACCEL_SENSOR_MCU (in, see main[4D], io[2D]), BRAKE_SENSOR_MCU (in, see main[4D], io[2C]), BUTTON_DEADMAN_MCU (in, see main[4C], io[5C]), BUTTON_EMERGENCY_MCU (in, see main[4C], io[8B]), BUTTON_LAP_MCU (in, see main[4C], io[7B]), BUTTON_PEDALS_CALIB_MCU (in, see main[4C], io[5B]), BUTTON_RESET_MCU (in, see main[4C], io[5C]), BUTTON_START_MCU (in, see main[4C], io[5C]), CAN_RX (in, see main[4C], io[8D]), CAN_TX (out, see main[4C], io[8D]), JTAG_RESET (out, see main[3C]), JTAG_SWCLK (out, see main[3C]), JTAG_SWDIO (out, see main[3C]), JTAG_SWO (in, see main[3C]), LCD_DC (out, see main[3C]), LCD_RST (out, see main[3C]), LCD_SPI_CS (out, see main[3C]), LCD_SPI_MISO (out, see main[3B]), LCD_SPI_MOSI (in, see main[3C]), LCD_SPI_SCLK (bidir, see main[3C]), LIGHT_BEAM_MCU (in, see main[4C], io[8C]), LIGHT_HAZARD_MCU (in, see main[4C], io[8C]), LIGHT_LEFT_INDICATOR_MCU (in, see main[4C], io[5D]), LIGHT_POSITION_MCU (in, see main[4C], io[5D]), LIGHT_RIGHT_INDICATOR_MCU (in, see main[4C], io[5D]), PA15 (see main[3B]), RGB_LEDS (out, see main[3B]), UART_RX (in, see main[4C]), UART_TX (out, see main[4C])

### Nets
+3V3: C3.1 C11.1 C12.1 C13.1 C14.1 C15.1 L1.2 L2.2 R2.2 R3.2 R11.2 U6.1(VBAT) U6.24(VDD_1) U6.36(VDD_2) U6.48(VDD_3)
AVDD: C24.1 C25.1 L2.1 U6.21(VDDA)
GND: C1.1 C2.1 C3.2 C4.2 C5.2 C6.2 C7.2 C8.2 C9.2 C11.2 C12.2 C13.2 C14.2 C15.2 C24.2 C25.2 LED1.2(K) LED2.2(K) LED3.2(K) LED4.2(K) R1.1 S1.1 S1.3 S2.1 S2.3 U6.19(VSSA) U6.23(VSS_1) U6.35(VSS_2) U6.47(VSS_3) X1.2(GND_1) X1.3(GND_2) X2.2(GND) X2.4(GND)
VREFP: C1.2 C2.2 L1.1 U6.20(VREF+)
ACCEL_SENSOR_MCU: U6.29(PB15) ; port ACCEL_SENSOR_MCU
BOOT0: R1.2 U6.45(PB8-BOOT0)
BRAKE_SENSOR_MCU: U6.28(PB14) ; port BRAKE_SENSOR_MCU
BUTTON_DEADMAN_MCU: U6.33(PA11) ; port BUTTON_DEADMAN_MCU
BUTTON_EMERGENCY_MCU: U6.34(PA12) ; port BUTTON_EMERGENCY_MCU
BUTTON_LAP_MCU: U6.30(PA8) ; port BUTTON_LAP_MCU
BUTTON_PEDALS_CALIB_MCU: U6.41(PB4) ; port BUTTON_PEDALS_CALIB_MCU
BUTTON_RESET_MCU: U6.31(PA9) ; port BUTTON_RESET_MCU
BUTTON_START_MCU: U6.32(PA10) ; port BUTTON_START_MCU
CAN_RX: U6.26(PB12) ; port CAN_RX
CAN_RX_LED: R13.2 U6.44(PB7)
CAN_TX: U6.27(PB13) ; port CAN_TX
CAN_TX_LED: R12.2 U6.43(PB6)
HSE_IN: C8.1 U6.5(PF0_-_OSC_IN) X2.1
HSE_OUT: C9.1 U6.6(PF1_-_OSC_OUT) X2.3
JTAG_RESET: C4.1 R2.1 S1.2 S1.4 U6.7(PG10_-_NRST) ; port JTAG_RESET
JTAG_SWCLK: U6.38(PA14) ; port JTAG_SWCLK
JTAG_SWDIO: U6.37(PA13) ; port JTAG_SWDIO
JTAG_SWO: U6.40(PB3) ; port JTAG_SWO
LCD_DC: R49.2 ; port LCD_DC
LCD_RST: R48.2 ; port LCD_RST
LCD_SPI_CS: R47.2 ; port LCD_SPI_CS
LCD_SPI_MISO: R45.2 ; port LCD_SPI_MISO
LCD_SPI_MOSI: R46.2 ; port LCD_SPI_MOSI
LCD_SPI_SCLK: R44.2 ; port LCD_SPI_SCLK
LIGHT_BEAM_MCU: U6.9(PA1) ; port LIGHT_BEAM_MCU
LIGHT_HAZARD_MCU: U6.8(PA0) ; port LIGHT_HAZARD_MCU
LIGHT_LEFT_INDICATOR_MCU: U6.12(PA4) ; port LIGHT_LEFT_INDICATOR_MCU
LIGHT_POSITION_MCU: U6.10(PA2) ; port LIGHT_POSITION_MCU
LIGHT_RIGHT_INDICATOR_MCU: U6.11(PA3) ; port LIGHT_RIGHT_INDICATOR_MCU
LSE_IN: C6.1 U6.3(PC14_-_OSC32_IN) X1.1(X1)
LSE_OUT: C7.1 U6.4(PC15_-_OSC32_OUT) X1.4(X2)
PA15: U6.39(PA15) ; port PA15
RGB_LEDS: U6.46(PB9) ; port RGB_LEDS
STATUS_LED: R37.2 U6.42(PB5)
TEST: C5.1 R3.1 S2.2 S2.4 U6.2(PC13)
UART_RX: U6.25(PB11) ; port UART_RX
UART_TX: U6.22(PB10) ; port UART_TX
NetLED1_1: LED1.1(A) R13.1
NetLED2_1: LED2.1(A) R12.1
NetLED3_1: LED3.1(A) R37.1
NetLED4_1: LED4.1(A) R11.1
NetR44_1: R44.1 U6.13(PA5)
NetR45_1: R45.1 U6.14(PA6)
NetR46_1: R46.1 U6.15(PA7)
NetR47_1: R47.1 U6.16(PB0)
NetR48_1: R48.1 U6.17(PB1)
NetR49_1: R49.1 U6.18(PB2)

### Notes on the sheet
- DWG. NO.
- REV.
- SHT.
- REVISION
- DESCRIPTION
- DATE
- APPROVED
- THIS DOCUMENT AND THE DATA DISCLOSED HEREIN OR HEREWITH IS THE PROPERTY OF ALTIUM LIMITED AND MAY BE FREELY DISTRIBUTED IN WHOLE. NO RIGHTS ARE RESERVED OR EXPRESS OR IMPLIED WARANTEE GIVEN.
- ENG:
- DSN:
- APPROVALS
- PROJECT
- DOCUMENT REVISION:
- DESIGN ITEM:
- CHK:
- BOM:
- REFERENCE DOCUMENTS
- PROJECT REVISION:
- TITLE
- FAB DWG:
- PCB DWG:
- ASSY DWG:
- SCALE:
- SIZE
- C
- CAGE CODE
- FILE NAME
- DWG NO.
- SHEET
- OF
- REV

### Library data of the parts
C1-C9 C11-C15 C24 C25 = CMP-1037-04778-1: as C28 on sheet main; Technology: SMT; Value: 1.8uF; Rated Voltage: 10 V; Max Thickness: 1.45 mm
L1 L2 = MPZ1608S601ATA00: Ferrite Beads Multi-Layer 600Ohm 25% 100MHz 1A 0.15Ohm DCR 0603 T/R; Manufacturer Lifecycle Status: PRODUCTION; MF: TDK; DC Resistance (DCR): 150mΩ; Impedance: 600Ω; Number of Circuits: 1; SnapEDA_Link: https://www.snapeda.com/parts/MPZ1608S601ATA00/TDK/view-part/?ref=snap; Package: 0603 TDK; Value: *; MP: MPZ1608S601ATA00; Check_prices: https://www.snapeda.com/parts/MPZ1608S601ATA00/TDK/view-part/?ref=eda; Supplier: Farnell; Supplier Part Number: 2800777; Manufacturer: TDK; Manufacturer Part Number: MPZ1608S601ATA00; RoHS: Compliant; Category: Ferrite Beads and Chips; Stock: 80000; Case/Package: 0603; Case Code (Imperial): 0603; Case Code (Metric): 1608; China RoHS: Compliant; Core Material: Ferrite; Current Rating: 1A; Depth: 800µm; Height: 800µm; Lead Free: Lead Free; Length: 1.6mm; Lifecycle Status: Production; Max DC Current: 1A; Clock Frequency: 100MHz; Max Length: 1.75mm; Max Operating Temperature: 125°C; Max Width: 950µm; Min Length: 1.45mm; Min Operating Temperature: -55°C; Min Width: 650µm; Mounting Technology: Surface Mount; Number of Terminals: 2; Packaging: Cut Tape; REACH SVHC: Yes; RMS Current (Irms): 1A; Schedule B: 8504500000, 8504500000|8504500000|8504500000|8504500000|8504500000; ESR: 150mΩ; Termination: SMD/SMT; Test Frequency: 100MHz; Tolerance: 25%; Weight: 2.012816mg; Width: 800µm; ComponentLink1URL: https://datasheet.octopart.com:443/MPZ1608S601ATA00-TDK-datasheet-155380319.pdf?src-supplier=TDK; ComponentLink1Description: https://datasheet.octopart.com:443/MPZ1608S601ATA00-TDK-datasheet-155380319.pdf?src-supplier=TDK; ComponentLink2URL: https://datasheet.octopart.com:443/MPZ1608S601ATA00-TDK-datasheet-141913842.pdf?src-supplier=TME; ComponentLink2Description: https://datasheet.octopart.com:443/MPZ1608S601ATA00-TDK-datasheet-141913842.pdf?src-supplier=TME; ComponentLink3URL: https://datasheet.octopart.com:443/MPZ1608S601ATA00-TDK-datasheet-82475260.pdf?src-supplier=Newark; ComponentLink3Description: https://datasheet.octopart.com:443/MPZ1608S601ATA00-TDK-datasheet-82475260.pdf?src-supplier=Newark; ComponentLink4URL: https://datasheet.octopart.com:443/MPZ1608S601ATA00-TDK-datasheet-99917310.pdf?src-supplier=Newark; ComponentLink4Description: https://datasheet.octopart.com:443/MPZ1608S601ATA00-TDK-datasheet-99917310.pdf?src-supplier=Newark; ComponentLink5URL: https://datasheet.octopart.com:443/MPZ1608S601ATA00-TDK-datasheet-8852356.pdf?src-supplier=Newark; ComponentLink5Description: https://datasheet.octopart.com:443/MPZ1608S601ATA00-TDK-datasheet-8852356.pdf?src-supplier=Newark; ComponentLink6URL: https://datasheet.octopart.com:443/MPZ1608S601ATA00-TDK-datasheet-21631858.pdf?src-supplier=Farnell; ComponentLink6Description: https://datasheet.octopart.com:443/MPZ1608S601ATA00-TDK-datasheet-21631858.pdf?src-supplier=Farnell; ComponentLink7URL: https://datasheet.octopart.com:443/MPZ1608S601ATA00-TDK-datasheet-38423207.pdf?src-supplier=Future+Electronics; ComponentLink7Description: https://datasheet.octopart.com:443/MPZ1608S601ATA00-TDK-datasheet-38423207.pdf?src-supplier=Future+Electronics
LED1-LED4 = CMP-2000-07124-1: Yellow LED, Water Clear Len, 585 nm, 2.1 V, -40 to 85 degC, 2-Pin SMD, RoHS, Tape and Reel; Manufacturer: Lumex; Product Training Modules: LEDsBenefitsofCustomLEDandLCDTechnology; Millicandela Rating: 6mcd; Catalog Drawings: SML-LX1206SeriesTopSML-LX1206SeriesSideSML-LX1206SeriesBottomSML-LX1206SeriesFootprint; Wavelength - Peak: 585nm; Other Names: 67-1358-2LU60357TRSMLLX1206YCTR; Lens Style/Size: RectanglewithFlatTop; Current - Test: 20mA; Lens Color: Colorless; Viewing Angle: 160°; Voltage - Forward (Vf) (Typ): 2.1V; Online Catalog: SML-LX1206RectanglewithFlatTop1206PackageLEDs; Mounting Type: SurfaceMount; Package Description: 2-Pin Surface Mount Device, Body 3.2 x 1.5 mm; Datasheet Version: Rev. K, 08/2012; Features: -; Color: Yellow; RoHS Information: RoHSCertofCompliance; Package Reference: SML-LX1206YC-TR; Supplier Device Package: 1206; Standard Package: 3,000; Series: -; Wavelength - Dominant: -; Package / Case: 1206(3216Metric); Mounting Technology: SurfaceMount; Height (Max): 1.10mm; Lens Transparency: Clear; Datasheet URL: http://www.lumex.com/content/files/ProductAttachment/SML-LX1206YC-TR.pdf; Family: LEDIndication-Discrete; Manufacturer URL: http://www.lumexinstruments.com/; Packaging: Tape&Reel(TR); Category: Optoelectronics; Size / Dimension: 3.20mmLx1.60mmW
R1-R3 R11-R13 R37 R44-R49 = CMP-04015-098385-1: 40.2kΩ ±1% 0.25W Chip Resistor 1206 Thick Film AEC-Q200 Qualified; Resistance: 40.2kR; Voltage Rating (DC): 200V; Temperature Coefficient: 100ppm/°C; Power Rating: 250mW; Tolerance: 1%; Package Quantity: 5000; Length: 3.2mm; Termination: SMD/SMT; Lead Free: Contains Lead; Case Code (Imperial): 1206; Case/Package: 1206; Voltage Rating: 200V; Case Code (Metric): 3216; Max Operating Temperature: 155°C; Packaging: Tape and Reel; Width: 1.6mm; Series: RK73H; Min Operating Temperature: -55°C; RoHS Compliant: No; Height: 0.6mm
S1 S2 = TL3305BF100QG: TL3305 Ultra-Miniature Tact Switch 100gf 5.0mm actuator Silver Contact Gullwing; Manufacturer_Name: E-Switch; Datasheet Link: https://configured-product-images.s3.amazonaws.com/2D/specs/TL3305BF100QG.pdf; Manufacturer_Part_Number: TL3305BF100QG; Mouser Part Number: 612-TL3305BF100QG; Mouser Price/Stock: https://www.mouser.co.uk/ProductDetail/E-Switch/TL3305BF100QG?qs=IKkN%2F947nfDIPwqPQja%252BvQ%3D%3D; Supplier: Farnell; Supplier Part Number: 4539028; Manufacturer: E-Switch; Manufacturer Part Number: TL3305BF100QG; RoHS: Compliant; Category: Tactile Switches; Stock: 11760; ComponentLink1URL: https://datasheet.octopart.com:443/TL3305BF100QG-E-Switch-datasheet-181388209.pdf?src-supplier=Future+Electronics; ComponentLink1Description: https://datasheet.octopart.com:443/TL3305BF100QG-E-Switch-datasheet-181388209.pdf?src-supplier=Future+Electronics; ComponentLink2URL: https://datasheet.octopart.com:443/TL3305BF100QG-E-Switch-datasheet-188129426.pdf?src-supplier=Future+Electronics; ComponentLink2Description: https://datasheet.octopart.com:443/TL3305BF100QG-E-Switch-datasheet-188129426.pdf?src-supplier=Future+Electronics
U6 = STM32G491CET6: ARM Microcontrollers - MCU Mainstream Arm Cortex-M4+ MCU 170MHz with 512Kbytes of Flash memory; Manufacturer_Name: STMicroelectronics; Geometry.Height: 1.6mm; Manufacturer_Part_Number: STM32G491CET6; Mouser Part Number: 511-STM32G491CET6; Mouser Price/Stock: https://www.mouser.co.uk/ProductDetail/STMicroelectronics/STM32G491CET6?qs=eP2BKZSCXI5LxAF%2FNuF5Tg%3D%3D; Arrow Part Number: STM32G491CET6; Arrow Price/Stock: https://www.arrow.com/en/products/stm32g491cet6/stmicroelectronics?region=nac; Datasheet Link: https://cz.mouser.com/datasheet/2/389/dm00654712-2042072.pdf; Supplier: Mouser; Supplier Part Number: 511-STM32G491CET6; Supplier 1: Mouser; Supplier Part Number 1: 511-STM32G491CET6; ComponentLink1Description: Datasheet; ComponentLink1URL: https://datasheet.octopart.com/STM32G491CET6-STMicroelectronics-datasheet-151949616.pdf?src-supplier=Future+Electronics
X1 = 9HT7-32.768KDZF-T: Parallel - Fundamental Quartz Crystal, 0.032768MHz Nom; Manufacturer_Name: TXC CORPORATION; Manufacturer: TXC; Geometry.Height: 1.4mm; ESR (Equivalent Series Resistance): 65kΩ; Frequency: 32.768kHz; Frequency Tolerance: 0.002%; Load Capacitance: 12.5pF; Manufacturer_Part_Number: 9HT7-32.768KDZF-T; Mouser Part Number: 717-9HT7-32.768KDZFT; Mouser Price/Stock: https://www.mouser.co.uk/ProductDetail/TXC-Corporation/9HT7-32.768KDZF-T?qs=MEJ8UTjcHDlobjP3Uu4Bsg%3D%3D; Arrow Part Number: 9HT7-32.768KDZF-T; Arrow Price/Stock: https://www.arrow.com/en/products/9ht7-32.768kdzf-t/txc-corporation?region=nac; Datasheet Link: https://componentsearchengine.com/Datasheets/2/9HT7-32.768KDZF-T.pdf; Supplier: Farnell; Supplier Part Number: 2819319; Manufacturer Part Number: 9HT7-32.768KDZF-T; RoHS: Compliant; Category: Crystals; Stock: 7957; Case/Package: SMD/SMT; Height: 508µm; Lead Free: Lead Free; Length: 1.4mm; Lifecycle Status: Production; Max Operating Temperature: 85°C; Min Operating Temperature: -40°C; Mounting Technology: Surface Mount; Packaging: Tape & Reel; REACH SVHC: No; Schedule B: 8541600080, 8541600080|8541600080|8541600080|8541600080|8541600080|8541600080|8541600080|8541600080|8541600080|8541600080|8541600080|8541600080|8541600080|8541600080|8541600080|8541600080|8541600080|8541600080|8541600080|8541600080|8541600080|8541600080|8541600080|85; Termination: SMD/SMT; Tolerance: 0.002%; Width: 1.397mm; ComponentLink1URL: https://datasheet.octopart.com:443/9HT7-32.768KDZF-T-TXC-datasheet-21225340.pdf?src-supplier=element14+APAC; ComponentLink1Description: https://datasheet.octopart.com:443/9HT7-32.768KDZF-T-TXC-datasheet-21225340.pdf?src-supplier=element14+APAC; ComponentLink2URL: https://datasheet.octopart.com:443/9HT7-32.768KDZF-T-TXC-datasheet-181441158.pdf?src-supplier=Newark; ComponentLink2Description: https://datasheet.octopart.com:443/9HT7-32.768KDZF-T-TXC-datasheet-181441158.pdf?src-supplier=Newark; ComponentLink3URL: https://datasheet.octopart.com:443/9HT7-32.768KDZF-T-TXC-datasheet-188932442.pdf?src-supplier=TME; ComponentLink3Description: https://datasheet.octopart.com:443/9HT7-32.768KDZF-T-TXC-datasheet-188932442.pdf?src-supplier=TME
X2 = ABM11W-24.0000MHZ-8-D1X-T3: Crystal, Quartz, 24 MHz, SMD, 2mm x 1.6mm x 0.5mm, 20 ppm, 8 pF, 10 ppm, ABM11W; Manufacturer: Abracon; MF: Abracon LLC; ESR (Equivalent Series Resistance): 100Ω; Frequency: 24MHz; Frequency Stability: 20ppm; Frequency Tolerance: 0.001%; Load Capacitance: 8pF; ESR: 30Ω; SnapEDA_Link: https://www.snapeda.com/parts/ABM11W-24.0000MHZ-8-D1X-T3/Abracon/view-part/?ref=snap; Package: SMD-4 Abracon LLC; Value: *; MP: ABM11W-24.0000MHZ-8-D1X-T3; Check_prices: https://www.snapeda.com/parts/ABM11W-24.0000MHZ-8-D1X-T3/Abracon/view-part/?ref=eda; Supplier: DigiKey; Supplier Part Number: 535-13835-1-ND; Manufacturer Part Number: ABM11W-24.0000MHZ-8-D1X-T3; RoHS: Compliant; Category: Crystals; Stock: 2752; Pricing: 1=0,38, 10=0,334, 25=0,3156, 50=0,3024, 100=0,29, 250=0,27424, 500=0,26288, 1000=0,25201 (USD); China RoHS: Compliant; Height: 500µm; Length: 2mm; Lifecycle Status: Production; Max Operating Temperature: 85°C; Min Operating Temperature: -40°C; Mounting Technology: Surface Mount; REACH SVHC: Yes; Tolerance: 0.001%; Width: 1.6mm; ComponentLink1URL: https://datasheet.octopart.com:443/ABM11W-24.0000MHZ-8-D1X-T3-Abracon-datasheet-154833168.pdf?src-supplier=IHS; ComponentLink1Description: https://datasheet.octopart.com:443/ABM11W-24.0000MHZ-8-D1X-T3-Abracon-datasheet-154833168.pdf?src-supplier=IHS; ComponentLink2URL: https://datasheet.octopart.com:443/ABM11W-24.0000MHZ-8-D1X-T3-Abracon-datasheet-102760955.pdf?src-supplier=Upverter; ComponentLink2Description: https://datasheet.octopart.com:443/ABM11W-24.0000MHZ-8-D1X-T3-Abracon-datasheet-102760955.pdf?src-supplier=Upverter; ComponentLink3URL: https://datasheet.octopart.com:443/ABM11W-24.0000MHZ-8-D1X-T3-Abracon-datasheet-112015802.pdf?src-supplier=Master+Electronics; ComponentLink3Description: https://datasheet.octopart.com:443/ABM11W-24.0000MHZ-8-D1X-T3-Abracon-datasheet-112015802.pdf?src-supplier=Master+Electronics; ComponentLink4URL: https://datasheet.octopart.com:443/ABM11W-24.0000MHZ-8-D1X-T3-Abracon-datasheet-182204996.pdf?src-supplier=Master+Electronics; ComponentLink4Description: https://datasheet.octopart.com:443/ABM11W-24.0000MHZ-8-D1X-T3-Abracon-datasheet-182204996.pdf?src-supplier=Master+Electronics; ComponentLink5URL: https://sigma.octopart.com:443/141159858/technical_drawing/Abracon-ABM11W-24.0000MHZ-8-D1X-T3.pdf?src-supplier=Abracon+SCT; ComponentLink5Description: https://sigma.octopart.com:443/141159858/technical_drawing/Abracon-ABM11W-24.0000MHZ-8-D1X-T3.pdf?src-supplier=Abracon+SCT; ComponentLink6URL: http://sigma.octopart.com:80/conflict_mineral_statement/Abracon-company-27.pdf?src-supplier=Compliance+Statements; ComponentLink6Description: http://sigma.octopart.com:80/conflict_mineral_statement/Abracon-company-27.pdf?src-supplier=Compliance+Statements